# Altium schematic sheet Sheet1.SchDoc
size A2
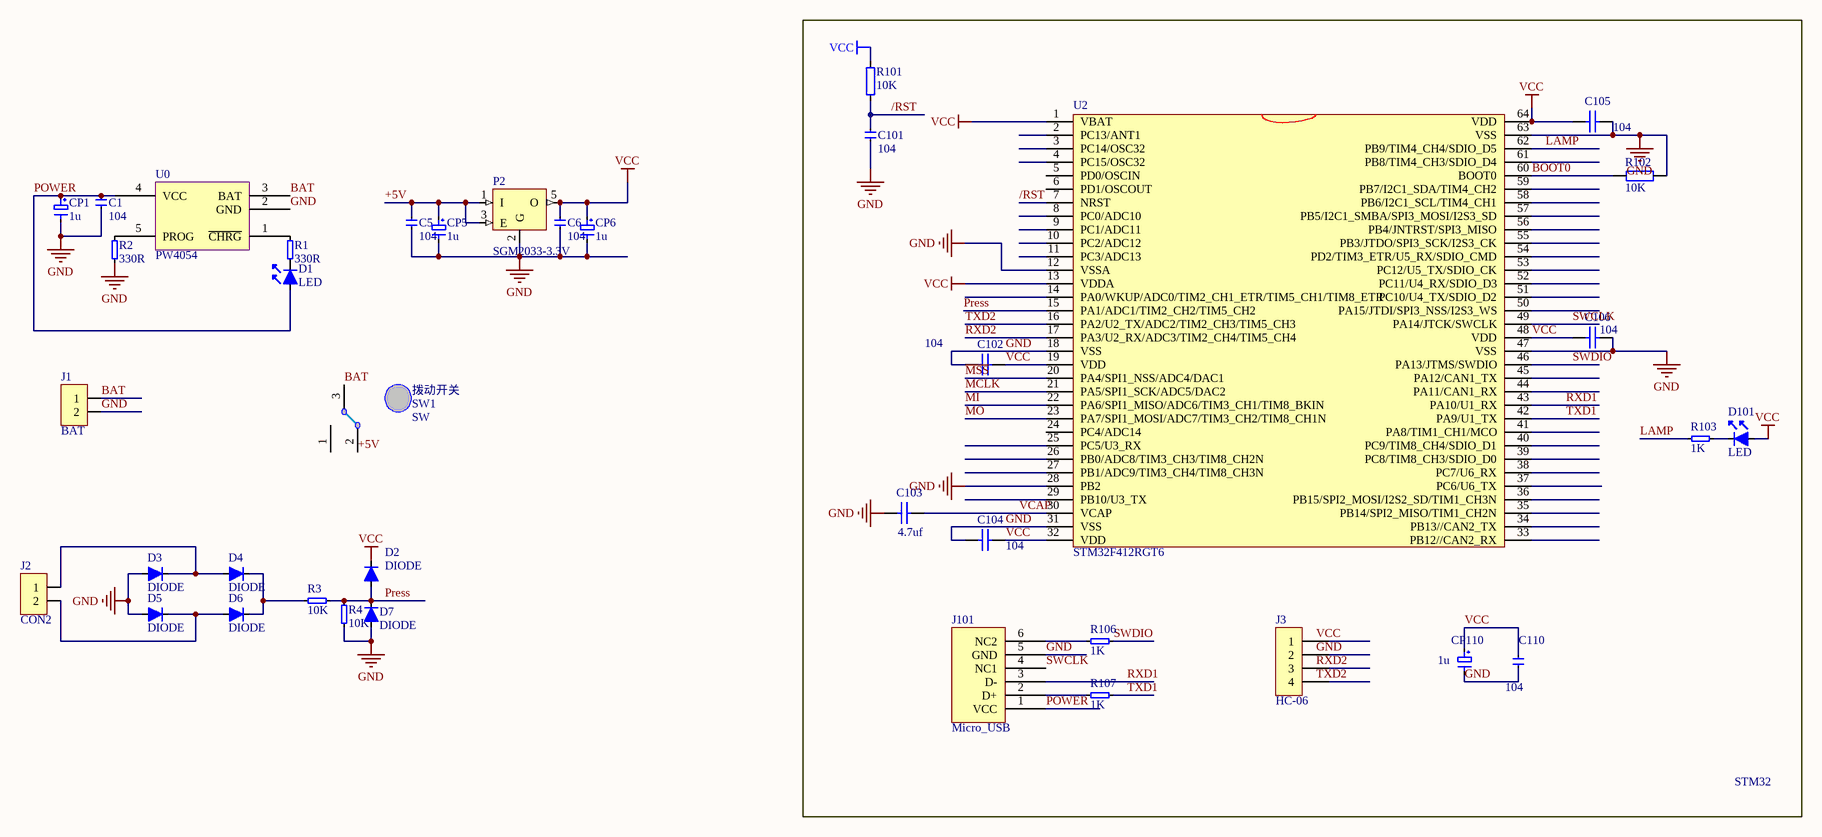
[diagram p0: Sheet1.SchDoc]

## Parts
C1  104  [0805]
C5  104  [0805]
C6  104  [0805]
C101  104  [0603]
C102  value 104  [0603]  (hidden comment: 50V22pF)
C103  value 4.7uf  [0603]  (hidden comment: 50V22pF)
C104  value 104  [0603]  (hidden comment: 50V22pF)
C105  value 104  [0603]  (hidden comment: 50V22pF)
C106  value 104  [0603]  (hidden comment: 50V22pF)
C110  104  [0805]
CP1  1u  [0805]
CP5  1u  [0805]
CP6  1u  [0805]
CP110  1u  [0805]
D1  LED  [LEDDIP]
D2  DIODE  [0805]
D3  DIODE  [0805]
D4  DIODE  [0805]
D5  DIODE  [0805]
D6  DIODE  [0805]
D7  DIODE  [0805]
D101  LED  [LEDDIP]
J1  BAT  [SIP2]
J2  CON2  [SIP2]
J3  HC-06  [SIP4]
J101  Micro_USB  [MICRO-USB]
P2  SGM2033-3.3V  [SOT23-5]
R1  330R  [0603]
R2  330R  [0603]
R3  10K  [0805]
R4  10K  [0805]
R101  10K  [0603]
R102  10K  [0603]
R103  1K  [0603]
R106  1K  [0603]
R107  1K  [0603]
SW1  SW  [SW3]
U0  PW4054  [SOT23-5]
U2  STM32F412RGT6  [LQFP64]

## Blocks framed on the sheet
STM32: C101-C106 C110 CP110 D101 J3 J101 R101-R103 R106 R107 U2

## Nets
GND: C1.2 C5.2 C6.2 C101.2 C102.2 C103.2 C104.2 C105.1 C106.1 C110.2 CP1.2 CP5.2 CP6.2 CP110.2 D3.1(A) D5.1(A) D7.1(A) J1.2 J101.5(GND) P2.2(G) R2.1 R4.2 R102.2 U0.2(GND) U2.12(VSSA) U2.18(VSS) U2.28(PB2) U2.31(VSS) U2.47(VSS) U2.63(VSS)
VCC: C6.1 C102.1 C104.1 C105.2 C106.2 C110.1 CP6.1 CP110.1 D2.2(K) D101.1(A) P2.5(O) R101.1 U2.1(VBAT) U2.13(VDDA) U2.19(VDD) U2.32(VDD) U2.48(VDD) U2.64(VDD)
+5V: C5.1 CP5.1 P2.1(I) P2.3(E) SW1.2
/RST: C101.1 R101.2 U2.7(NRST)
BAT: J1.1 SW1.3 U0.3(BAT)
BOOT0: R102.1 U2.60(BOOT0)
LAMP: R103.1 U2.62(PB9/TIM4_CH4/SDIO_D5)
~{MSS}: U2.20(PA4/SPI1_NSS/ADC4/DAC1)
MCLK: U2.21(PA5/SPI1_SCK/ADC5/DAC2)
MI: U2.22(PA6/SPI1_MISO/ADC6/TIM3_CH1/TIM8_BKIN)
MO: U2.23(PA7/SPI1_MOSI/ADC7/TIM3_CH2/TIM8_CH1N)
POWER: C1.1 CP1.1 D1.1(A) J101.1(VCC) U0.4(VCC)
Press: D2.1(A) D7.2(K) R3.1 R4.1 U2.15(PA1/ADC1/TIM2_CH2/TIM5_CH2)
RXD1: J101.3(D-) U2.43(PA10/U1_RX)
RXD2: U2.17(PA3/U2_RX/ADC3/TIM2_CH4/TIM5_CH4)
SWCLK: J101.4(NC1) U2.49(PA14/JTCK/SWCLK)
SWDIO: R106.2 U2.46(PA13/JTMS/SWDIO)
TXD1: R107.2 U2.42(PA9/U1_TX)
TXD2: U2.16(PA2/U2_TX/ADC2/TIM2_CH3/TIM5_CH3)
VCAP: C103.1 U2.30(VCAP)
NetD1_2: D1.2(K) R1.1
NetD3_2: D3.2(K) D4.1(A) J2.1
NetD4_2: D4.2(K) D6.2(K) R3.2
NetD5_2: D5.2(K) D6.1(A) J2.2
NetD101_2: D101.2(K) R103.2
NetJ101_2: J101.2(D+) R107.1
NetJ101_6: J101.6(NC2) R106.1
NetR1_2: R1.2 U0.1(~{CHRG})
NetR2_2: R2.2 U0.5(PROG)

Not connected (* = marked no-connect by the designer): J3 1 2 3 4; SW1 1; U2 2(PC13/ANT1) 3(PC14/OSC32) 4(PC15/OSC32) 5(PD0/OSCIN) 6(PD1/OSCOUT) 8(PC0/ADC10) 9(PC1/ADC11) 10(PC2/ADC12) 11(PC3/ADC13) 14(PA0/WKUP/ADC0/TIM2_CH1_ETR/TIM5_CH1/TIM8_ETR) 24(PC4/ADC14) 25(PC5/U3_RX) 26(PB0/ADC8/TIM3_CH3/TIM8_CH2N) 27(PB1/ADC9/TIM3_CH4/TIM8_CH3N) 29(PB10/U3_TX) 33(PB12//CAN2_RX) 34(PB13//CAN2_TX) 35(PB14/SPI2_MISO/TIM1_CH2N) 36(PB15/SPI2_MOSI/I2S2_SD/TIM1_CH3N) 37(PC6/U6_TX) 38(PC7/U6_RX) 39(PC8/TIM8_CH3/SDIO_D0) 40(PC9/TIM8_CH4/SDIO_D1) 41(PA8/TIM1_CH1/MCO) 44(PA11/CAN1_RX) 45(PA12/CAN1_TX) 50(PA15/JTDI/SPI3_NSS/I2S3_WS) 51(PC10/U4_TX/SDIO_D2) 52(PC11/U4_RX/SDIO_D3) 53(PC12/U5_TX/SDIO_CK) 54(PD2/TIM3_ETR/U5_RX/SDIO_CMD) 55(PB3/JTDO/SPI3_SCK/I2S3_CK) 56(PB4/JNTRST/SPI3_MISO) 57(PB5/I2C1_SMBA/SPI3_MOSI/I2S3_SD) 58(PB6/I2C1_SCL/TIM4_CH1) 59(PB7/I2C1_SDA/TIM4_CH2) 61(PB8/TIM4_CH3/SDIO_D4)

## Notes on the sheet
- 拨动开关
- Labels drawn without touching a wire or pin: GND, RXD2, TXD2, VCC

## Library data of the parts
C1 C101 C110 = CAP
C5 C6 = CAP: 1uF
C102-C106 = Cap1: Capacitor; Published: 8-Jun-2000; Revision: July-2002: Re-released for DXP Platform.; Publisher: Altium Limited
CP1 CP5 CP6 CP110 = CAP+
D1 D101 = LAMP
J1 J2 = CON2: Conjunctor
J3 = CON4
P2 = SGM2033
R1-R4 R103 R106 R107 = RES
R101 = RESISTANCE: RES
R102 = R